# Altium schematic sheet Power_Supply.SchDoc: Power Supply
size A4; Date: Not used; ApprovedBy: Not used; CheckedBy: Not used; Author: Not used; CompanyName: STMicroelectronics; DrawnBy: Not used; Engineer: Not used; Organization: Not used; Address1: Not used; Address2: Not used; Address3: Not used; Address4: Not used; DocumentNumber: Not used; Revision: Not used; SheetNumber: 5; SheetTotal: 6; CurrentTime: Not used; CurrentDate: Not used; Time: Not used; DocumentFullPathAndName: Not used; DocumentName: Not used; ModifiedDate: Not used; ImagePath: Not used; ProjectName: Not used; Application_BuildNumber: Not used
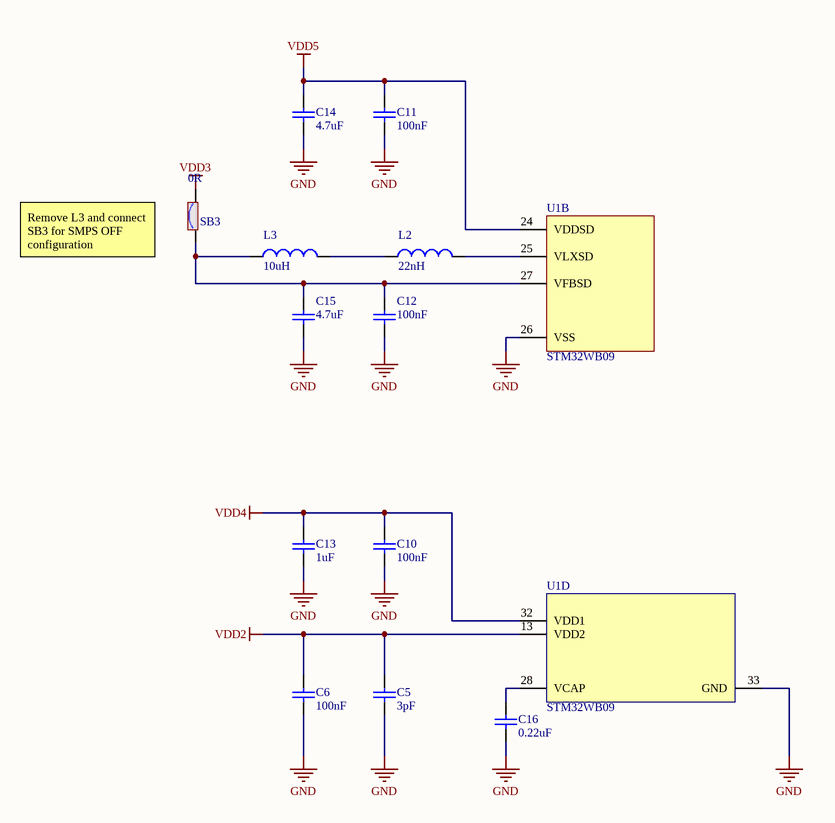
[diagram p0: Power_Supply.SchDoc]

## Parts
C5  value 3pF  [C0402]  (hidden comment: Capacitor)
C6  value 100nF  [C0402]  (hidden comment: Capacitor)
C10  value 100nF  [C0402]  (hidden comment: Capacitor)
C11  value 100nF  [C0402]  (hidden comment: Capacitor)
C12  value 100nF  [C0402]  (hidden comment: Capacitor)
C13  value 1uF  [C0402]  (hidden comment: Capacitor)
C14  value 4.7uF  [C0402]  (hidden comment: Capacitor)
C15  value 4.7uF  [C0402]  (hidden comment: Capacitor)
C16  value 0.22uF  [C0402]  (hidden comment: Capacitor)
L2  value 22nH  [C0402]  (hidden comment: Inductor)
L3  value 10uH  [IND_0805_MURATA_LQM21]  (hidden comment: Inductor)
SB3  value 0R  [SOLDER-BRIDGE_R0402-0R]  (hidden comment: SB_ON)
U1  STM32WB09  [ICC_QFN32-EPAD_5X5_P050]  (parts B,D of 5)

## Nets
GND: C5.1 C6.1 C10.1 C11.1 C12.1 C13.1 C14.1 C15.1 C16.1 U1.26(VSS) U1.33(GND)
VDD2: C5.2 C6.2 U1.13(VDD2)
VDD3: SB3.2
VDD4: C10.2 C13.2 U1.32(VDD1)
VDD5: C11.2 C14.2 U1.24(VDDSD)
NetC12_2: C12.2 C15.2 L3.1 SB3.1 U1.27(VFBSD)
NetC16_2: C16.2 U1.28(VCAP)
NetL2_1: L2.1 L3.2
NetL2_2: L2.2 U1.25(VLXSD)

## Notes on the sheet
- (near SB3) Remove L3 and connect SB3 for SMPS OFF configuration
- Title:
- Project:
- Size:
- Revision:
- Variant:
- A4
- -
- Date:
- Reference:
- Sheet:
- of

## Library data of the parts
C5 = MCD-03898: Capacitor, C0G, 3 pF, 50V, NPO, ±0.1pF, 0402, T=0.5mm; Part_Preference: Recommended; Manufacturer: WALSIN TECHNOLOGY CORPORATION; Manufacturer_Part_Number: 0402N3R0B500CT; Order_Code_RS: NA; ShowFields: YES; ID: 6014; Internal_Part_Number: MCD-03898; Status: New; Part_Type: Capacitor; Package: 0402; ComponentLink1URL: http://tunmcdsvn.tun.st.com/Component_Documentation_Library/Trunk/Capacitor/WALSIN_Monolithic_Series/0402N3R0B500CT; Order_Code_Digikey: 1292-1315-2-ND; Order_Code_Farnell: NA
C6 C10-C12 = MCD-03442: Capacitor, MLCC, 100nF, ±10%, X7R, 25V, 0402, T=0.5mm; Part_Preference: Recommended; Manufacturer: MURATA; Manufacturer_Part_Number: GRM155R71E104KE14D; Order_Code_RS: NA; ShowFields: YES; ID: 5558; Component_Country_Of_Origin: China, Japan, Philippines, Singapore; Internal_Part_Number: MCD-03442; Status: Checked; Part_Type: Capacitor; Package: 0402; ComponentLink1URL: http://tunmcdsvn.tun.st.com/Component_Documentation_Library/Trunk/Capacitor/MURATA_GRM_Series/GRM155R71E104KE14; Order_Code_Digikey: 490-10698-2-ND; Order_Code_Farnell: NA
C13 = MCD-03432: Capacitor, MLCC, 1uF, X7R, 6.3V, 0402, ± 10%, T=0.5mm; Part_Preference: Recommended; Manufacturer: MURATA; Manufacturer_Part_Number: GRM155R70J105KA12; Order_Code_RS: 113-8711; ShowFields: YES; ID: 5548; Component_Country_Of_Origin: China, Japan, Philippines, Singapore; Internal_Part_Number: MCD-03432; Status: Checked; Part_Type: Capacitor; Package: 0402; ComponentLink1URL: http://tunmcdsvn.tun.st.com/Component_Documentation_Library/Trunk/Capacitor/MURATA_GRM_Series/GRM155R70J105KA12; Order_Code_Digikey: NA; Order_Code_Farnell: NA
C14 C15 = MCD-03431: Capacitor, MLCC, 4.7uF, X5R, 10 V, 0402, ± 20%, T=0.5mm; Part_Preference: Recommended; Manufacturer: MURATA; Manufacturer_Part_Number: GRM155R61A475MEAAD; Order_Code_RS: 172-6870; ShowFields: YES; ID: 5547; Component_Country_Of_Origin: China, Japan, Philippines, Singapore; Internal_Part_Number: MCD-03431; Status: Checked; Part_Type: Capacitor; Package: 0402; ComponentLink1URL: http://tunmcdsvn.tun.st.com/Component_Documentation_Library/Trunk/Capacitor/MURATA_GRM_Series/GRM155R61A475MEAAD; Order_Code_Digikey: 90-14306-2-ND; Order_Code_Farnell: 2688503RL
C16 = MCD-03483: Capacitor, MLCC, 0.22uF, X5R, 6.3V, +/-10%, 0402, T=0.5mm; Part_Preference: Recommended; Manufacturer: YAGEO; Manufacturer_Part_Number: CC0402KRX5R5BB224; Order_Code_RS: 3369131; ShowFields: YES; ID: 5599; Component_Country_Of_Origin: China; Internal_Part_Number: MCD-03483; Status: Checked; Part_Type: Capacitor; Package: 0402; ComponentLink1URL: http://tunmcdsvn.tun.st.com/Component_Documentation_Library/Trunk/Capacitor/YAGEO_X5R_Series; Order_Code_Digikey: 311-1681-2-ND; Order_Code_Farnell: 3369131
L2 = MCD-03439: Inductor, MLCC, 22nH, ±2%, 350mA, 0.58R, 0402, T=1.45mm; Part_Preference: Recommended; Manufacturer: MURATA; Manufacturer_Part_Number: LQG15HN22NG02D; Order_Code_RS: 3354168; ShowFields: YES; ID: 5555; Component_Country_Of_Origin: Japan; Internal_Part_Number: MCD-03439; Status: Checked; Part_Type: Inductor; Package: 0402; ComponentLink1URL: http://tunmcdsvn.tun.st.com/Component_Documentation_Library/Trunk/Inductor/MURATA_LQG15HN22NG02D; Order_Code_Digikey: 490-LQG15HN22NG02DTR-ND; Order_Code_Farnell: 3354168
L3 = MCD-03438: Inductor, MLCC, 10uH, ±20%, 300mA, 845mR, 0805, T=1.45mm; Part_Preference: Recommended; Manufacturer: MURATA; Manufacturer_Part_Number: LQM21DN100M70L; Order_Code_RS: NA; ShowFields: YES; ID: 5554; Component_Country_Of_Origin: Japan; Internal_Part_Number: MCD-03438; Status: Checked; Part_Type: Inductor; Package: 0805; ComponentLink1URL: http://tunmcdsvn.tun.st.com/Component_Documentation_Library/Trunk/Inductor/MURATA_LQM21DN100M70L; Order_Code_Digikey: 490-LQM21DN100M70LTR-ND; Order_Code_Farnell: NA
SB3 = MCD-01618: Solder Bridge 0402 ON; Part_Type: Resistor; Part_Preference: Recommended; Manufacturer: YAGEO; Manufacturer_Part_Number: RC0402JR-070RL; Order_Code_RS: 618-5804; Component_Country_Of_Origin: China; ShowFields: YES; ID: 3718; Internal_Part_Number: MCD-01618; Status: Released; Package: 0402; ComponentLink1URL: http://tunmcdsvn.tun.st.com/Component_Documentation_Library/Trunk/Resistor/YAGEO_RC0402_Series; Order_Code_Digikey: 311-0.0JRTR-ND; Order_Code_Farnell: 2363467
U1 = MCD-03444: Bluetooth® Low Energy wireless SoC; Part_Type: IC; Part_Preference: Recommended; Manufacturer: STMICROELECTRONICS; Component_Country_Of_Origin: Unknown; ShowFields: YES; ID: 5560; Internal_Part_Number: MCD-03444; Value: STM32WB09; Status: Checked; Manufacturer_Part_Number: STM32WB09; Package: QFN32; ComponentLink1URL: http://tunmcdsvn.tun.st.com/Component_Documentation_Library/Trunk/IC/STMICROELECTRONICS_BLUENRG-372AC; Order_Code_Digikey: N/A; Order_Code_Farnell: N/A; Order_Code_RS: N/A